# EasyEDA schematic SCH_simple_bracelet_2025-11-06.json
TITLE: simple_bracelet; REV: 1.0; Date: 2025-11-06; Sheet: 1/1; Drawn By: Gutierrez, Lucas; Company: Stream SA
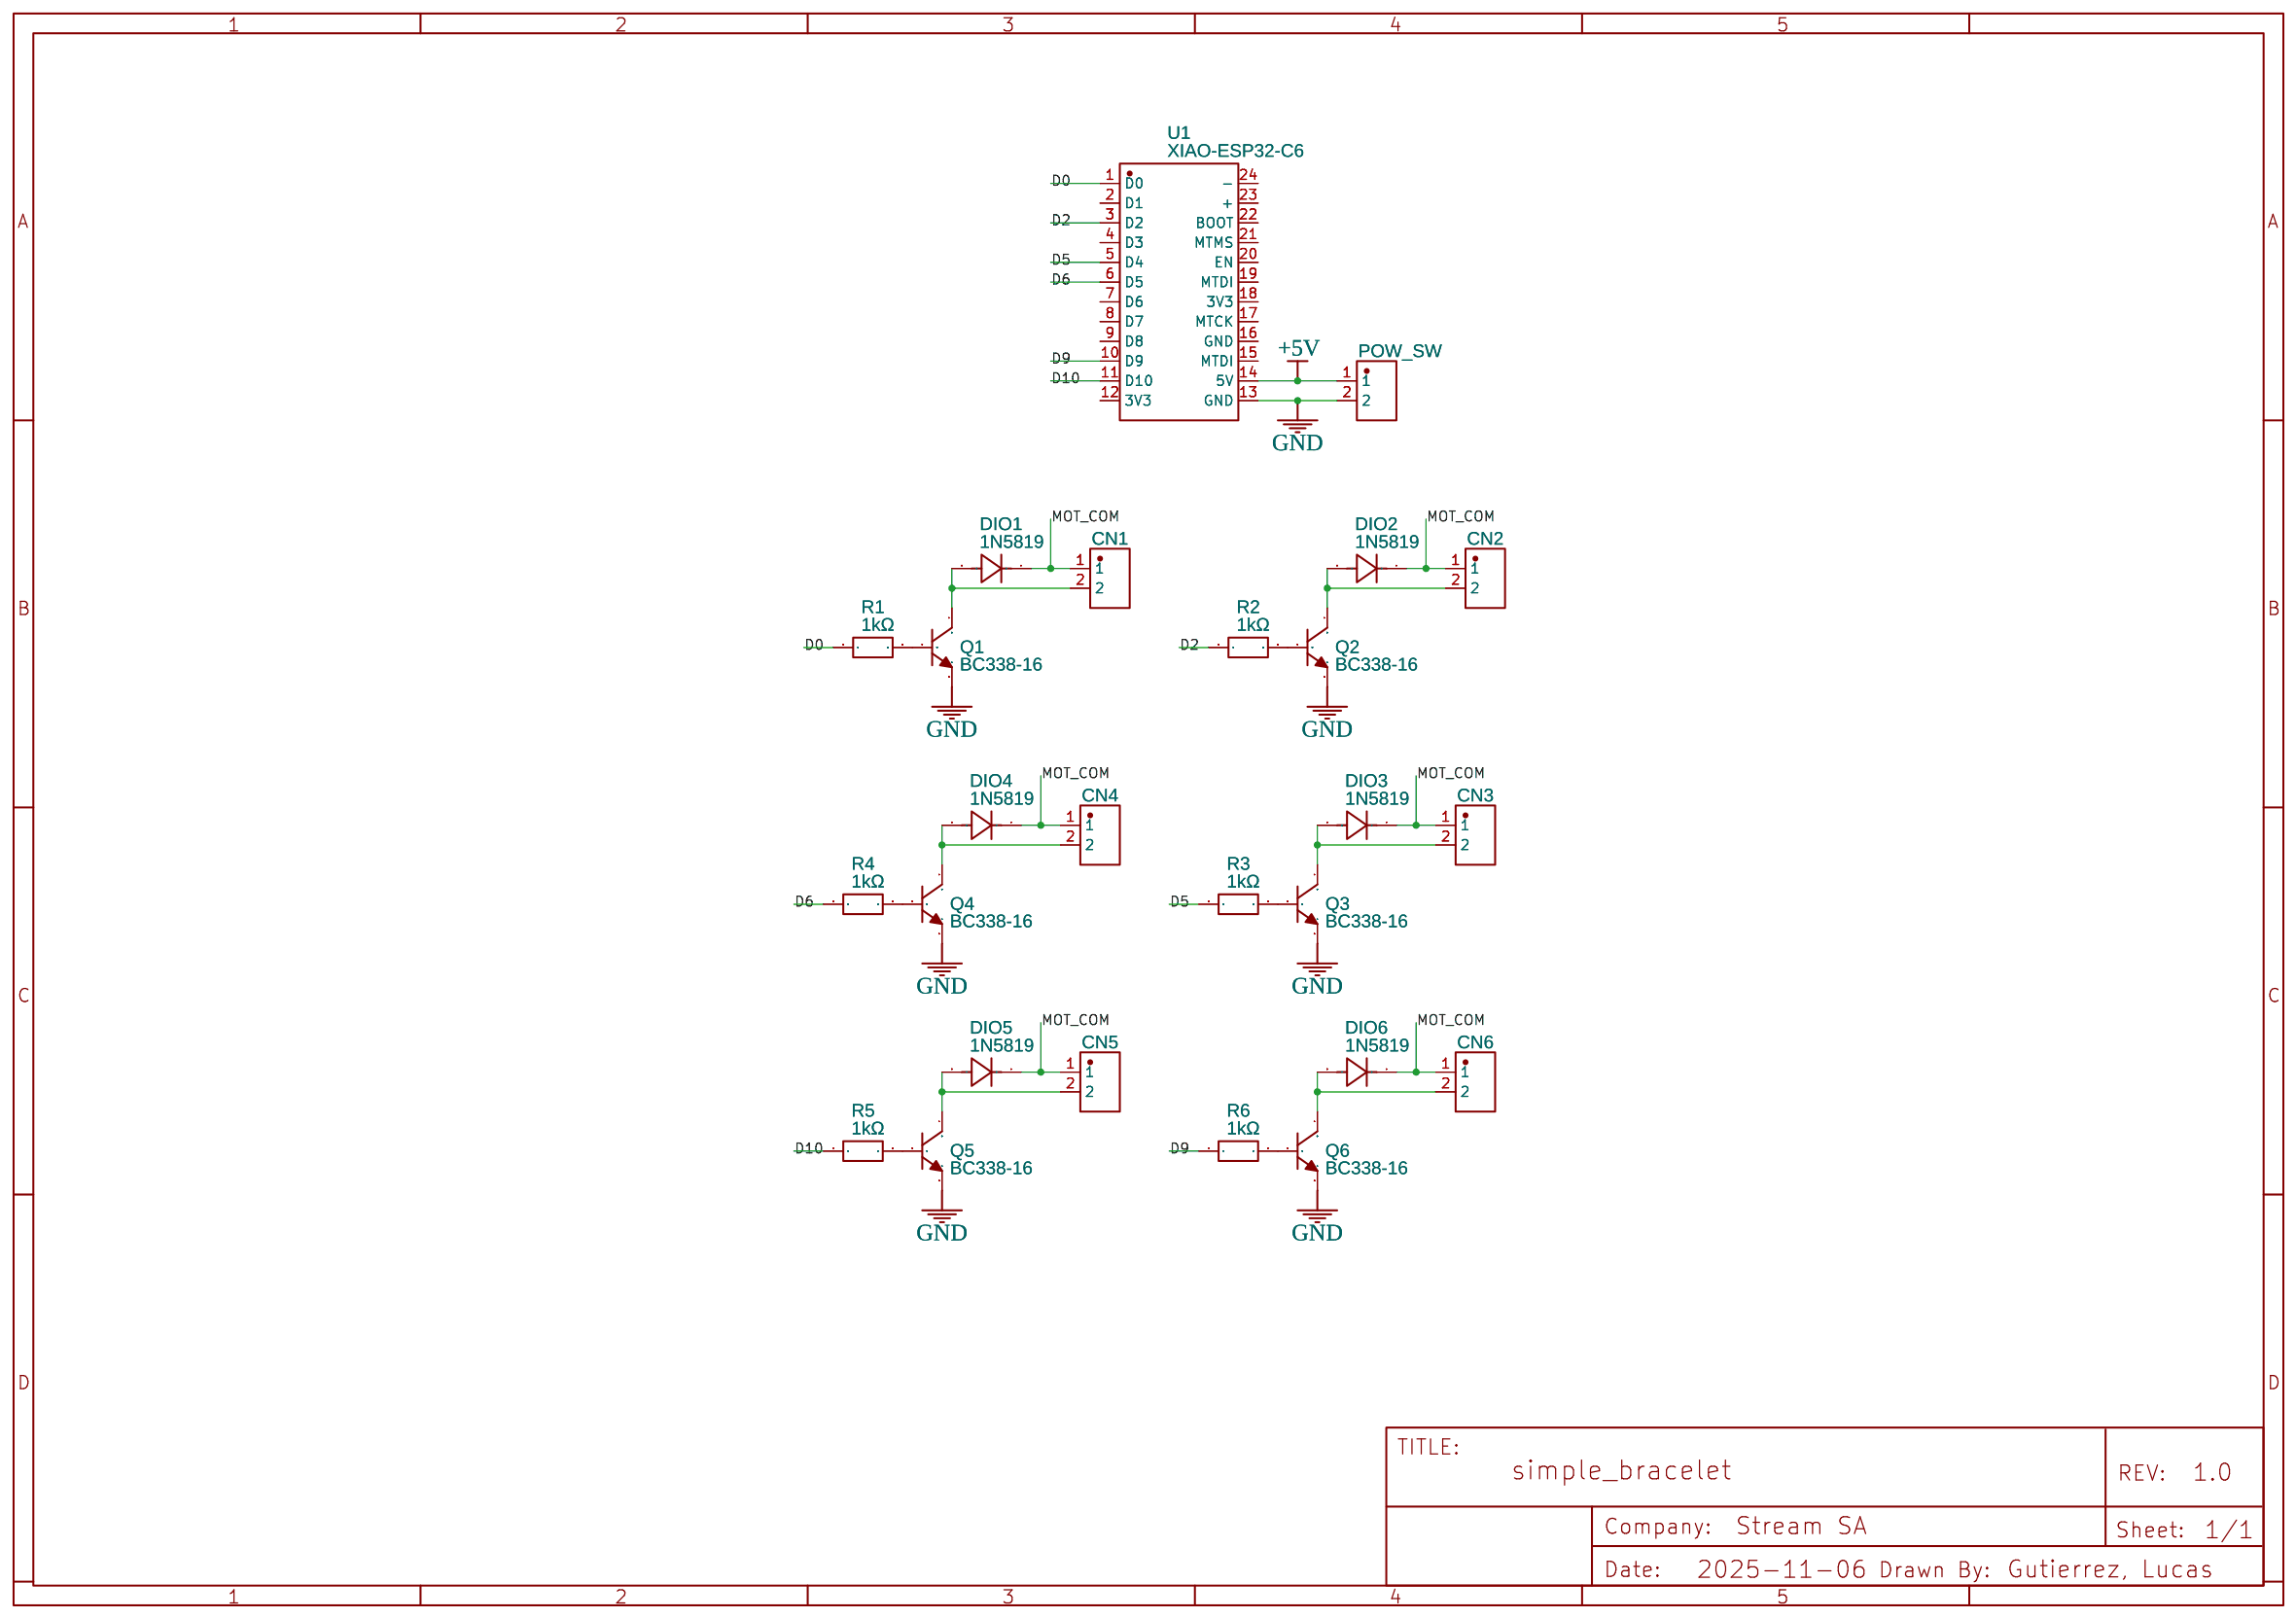
[diagram p0: schematic sheet]

## Parts
CN1  2.54-2P WZDK-R PITCH CONNECTOR  [CONN-TH_2.54-2P-WZDK-R-PITCH-CONNECTOR]
CN2  2.54-2P WZDK-R PITCH CONNECTOR  [CONN-TH_2.54-2P-WZDK-R-PITCH-CONNECTOR]
CN3  2.54-2P WZDK-R PITCH CONNECTOR  [CONN-TH_2.54-2P-WZDK-R-PITCH-CONNECTOR]
CN4  2.54-2P WZDK-R PITCH CONNECTOR  [CONN-TH_2.54-2P-WZDK-R-PITCH-CONNECTOR]
CN5  2.54-2P WZDK-R PITCH CONNECTOR  [CONN-TH_2.54-2P-WZDK-R-PITCH-CONNECTOR]
CN6  2.54-2P WZDK-R PITCH CONNECTOR  [CONN-TH_2.54-2P-WZDK-R-PITCH-CONNECTOR]
DIO1  1N5819  [DO-41_BD2.4-L4.7-P8.70-D0.9-RD]
DIO2  1N5819  [DO-41_BD2.4-L4.7-P8.70-D0.9-RD]
DIO3  1N5819  [DO-41_BD2.4-L4.7-P8.70-D0.9-RD]
DIO4  1N5819  [DO-41_BD2.4-L4.7-P8.70-D0.9-RD]
DIO5  1N5819  [DO-41_BD2.4-L4.7-P8.70-D0.9-RD]
DIO6  1N5819  [DO-41_BD2.4-L4.7-P8.70-D0.9-RD]
POW_SW  2.54-2P WZDK-R PITCH CONNECTOR  [CONN-TH_2.54-2P-WZDK-R-PITCH-CONNECTOR]
Q1  BC338-16  [TO-92-3_L5.1-W4.1-P1.27-L]
Q2  BC338-16  [TO-92-3_L5.1-W4.1-P1.27-L]
Q3  BC338-16  [TO-92-3_L5.1-W4.1-P1.27-L]
Q4  BC338-16  [TO-92-3_L5.1-W4.1-P1.27-L]
Q5  BC338-16  [TO-92-3_L5.1-W4.1-P1.27-L]
Q6  BC338-16  [TO-92-3_L5.1-W4.1-P1.27-L]
R1  1kΩ  [RES-TH_L48.0-W10.0-P51.00-D0.8]
R2  1kΩ  [RES-TH_L48.0-W10.0-P51.00-D0.8]
R3  1kΩ  [RES-TH_L48.0-W10.0-P51.00-D0.8]
R4  1kΩ  [RES-TH_L48.0-W10.0-P51.00-D0.8]
R5  1kΩ  [RES-TH_L48.0-W10.0-P51.00-D0.8]
R6  1kΩ  [RES-TH_L48.0-W10.0-P51.00-D0.8]
U1  XIAO-ESP32-C6  [LCC-14P_L17.7-W20.8-XIAO-ESP32-C6]

## Library data of the parts
CN1-CN6 POW_SW = 2.54-2P WZDK-R PITCH CONNECTOR: Supplier: LCSC; Supplier Part: C49023803; Manufacturer: SHOU HAN(首韩); Manufacturer Part: 2.54-2P WZDK-R Pitch Connector; JLCPCB Part Class: Extended Part; Contributor: lcsc
DIO1-DIO6 = 1N5819散装0658: Supplier: LCSC; Supplier Part: C2906380; Manufacturer: YFW(佑风微); JLCPCB Part Class: Extended Part; Contributor: lcsc
Q1-Q6 = BC338-16: Contributor: LCSC; Supplier: LCSC; Supplier Part: C2903842; Manufacturer: LGE(鲁光); JLCPCB Part Class: Extended Part
R1-R6 = CERAMIC RESISTOR 10W/ 2,2 OHM: Supplier: LCSC; Supplier Part: C7107345; Manufacturer: Visaton; Contributor: lcsc; JLCPCB Part Class: Extended Part
U1 = XIAO-ESP32-C6: Supplier: LCSC; Supplier Part: C9900124963; Manufacturer: null; JLCPCB Part Class: Extended Part; Contributor: lcsc

## Nets
+5V: POW_SW.1 U1.14(5V)
GND: POW_SW.2 Q1.3(E) Q2.3(E) Q3.3(E) Q4.3(E) Q5.3(E) Q6.3(E) U1.13(GND)
D0: R1.1 U1.1(D0)
D2: R2.1 U1.3(D2)
D5: R3.1 U1.5(D4)
D6: R4.1 U1.6(D5)
D9: R6.1 U1.10(D9)
D10: R5.1 U1.11(D10)
MOT_COM: CN1.1 CN2.1 CN3.1 CN4.1 CN5.1 CN6.1 DIO1.1(K) DIO2.1(K) DIO3.1(K) DIO4.1(K) DIO5.1(K) DIO6.1(K)
Net-(CN1-2): CN1.2 DIO1.2(A) Q1.1(C)
Net-(CN2-2): CN2.2 DIO2.2(A) Q2.1(C)
Net-(CN3-2): CN3.2 DIO3.2(A) Q3.1(C)
Net-(CN4-2): CN4.2 DIO4.2(A) Q4.1(C)
Net-(CN5-2): CN5.2 DIO5.2(A) Q5.1(C)
Net-(CN6-2): CN6.2 DIO6.2(A) Q6.1(C)
Net-(Q1-2): Q1.2(B) R1.2
Net-(Q2-2): Q2.2(B) R2.2
Net-(Q3-2): Q3.2(B) R3.2
Net-(Q4-2): Q4.2(B) R4.2
Net-(Q5-2): Q5.2(B) R5.2
Net-(Q6-2): Q6.2(B) R6.2

Not connected (* = marked no-connect by the designer): U1 2(D1) 4(D3) 7(D6) 8(D7) 9(D8) 12(3V3) 15(MTDI) 16(GND) 17(MTCK) 18(3V3) 19(MTDI) 20(EN) 21(MTMS) 22(BOOT) 23(+) 24(-)
